# EAGLE schematic Schematic_lamp (EAGLE 9.7.0)
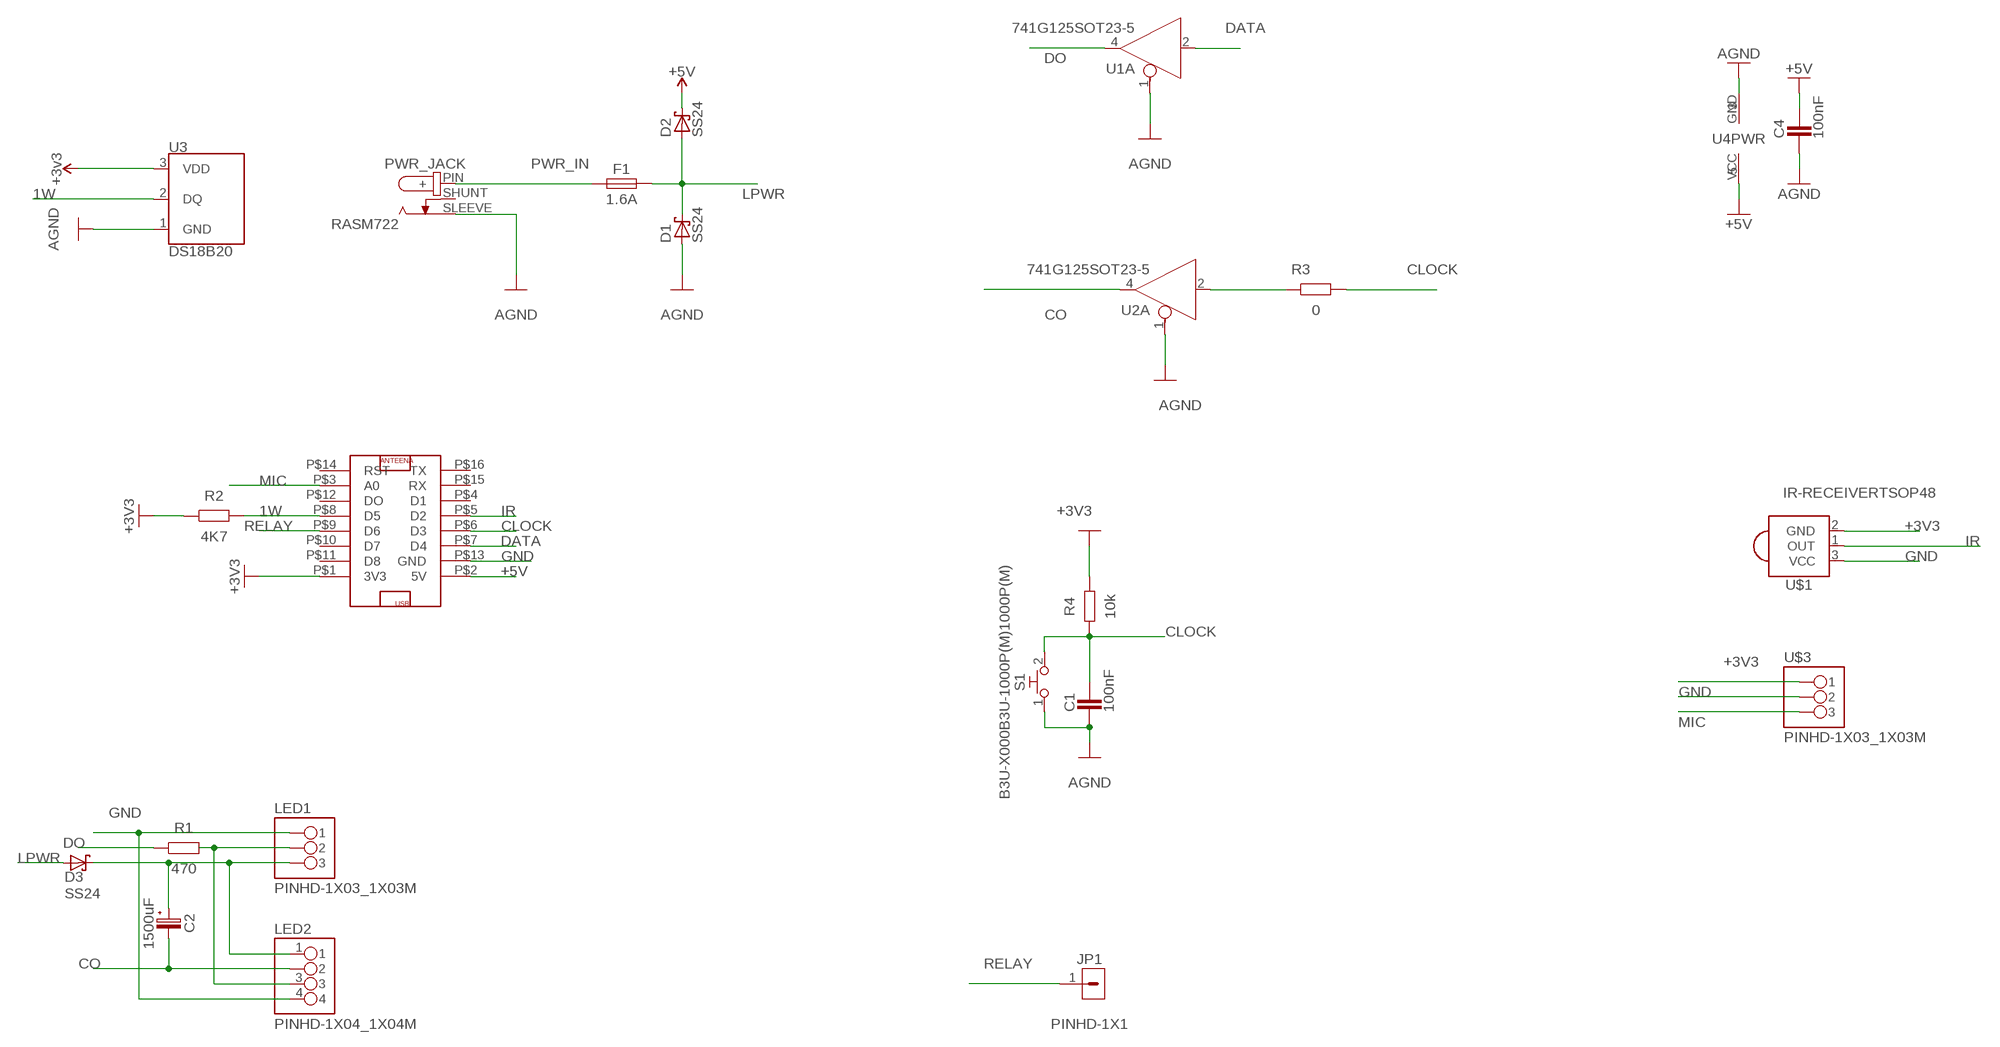
[diagram p0: schematic, sheet 1]

## Parts
C1  100nF  CAPACITOR_CHIP-0402(1005-METRIC)  [CAPC1005X60]
C2  1500uF  C-POL_TANTALUM-1206(3216-METRIC)  [CAPMP3216X180N]
C4  100nF  CAPACITOR_CHIP-0402(1005-METRIC)  [CAPC1005X60]
D1  SS24  SCHOTTKY-DIODEDO13M  [DO13M]
D2  SS24  SCHOTTKY-DIODEDO13M  [DO13M]
D3  SS24  SCHOTTKY-DIODEDO13M  [DO13M]
F1  1.6A  FUSE_AXIAL-26MM-PITCH  [FUSAD2590W70L2150D550B]
JP1  PINHD-1X1  [1X01]
LED1  PINHD-1X03_1X03M  [1X03]
LED2  PINHD-1X04_1X04M  [1X04]
PWR_JACK  RASM722  [RASM722X]
R1  470  R_CHIP-0402(1005-METRIC)  [RESC1005X40]
R2  4K7  R_CHIP-0402(1005-METRIC)  [RESC1005X40]
R3  0  R_CHIP-0402(1005-METRIC)  [RESC1005X40]
R4  10k  R_CHIP-0402(1005-METRIC)  [RESC1005X40]
S1  B3U-X000B3U-1000P(M)1000P(M)  [B3U-1000P(M)]
U1  741G125SOT23-5  [SOT23-5]
U2  741G125SOT23-5  [SOT23-5]
U3  DS18B20  [TO-92-AMMO]
U4  741G125SOT23-5  [SOT23-5]
U$1  IR-RECEIVERTSOP48  [TSOP48]
U$2  WEMOS-D1-MINI  [LAB_PACKAGE]
U$3  PINHD-1X03_1X03M  [1X03]

## Nets
1W: R2.2 U3.2(DQ) U$2.P$8(D5)
+3V3: R2.1 R4.2 U$1.2(GND) U$2.P$1(3V3) U$3.1
+5V: C4.1 U4.5(PWR:VCC) U$2.P$2(5V)
AGND: C1.2 C4.2 D1.A PWR_JACK.SLEEVE(NEG) S1.1 U1.1(A:OE) U2.1(A:OE) U3.1(GND) U4.3(PWR:GND)
CLOCK: C1.1 R3.2 R4.1 S1.2 U$2.P$6(D3)
CO: C2.2(-) LED2.2 U2.4(A:O)
DATA: U1.2(A:I) U$2.P$7(D4)
DO: R1.1 U1.4(A:O)
GND: LED1.1 LED2.4 U$1.3(VCC) U$2.P$13(GND) U$3.2
IR: U$1.1(OUT) U$2.P$5(D2)
LPWR: C2.1(+) D1.C D2.A D3.A D3.C F1.2 LED1.3 LED2.1
MIC: U$2.P$3(A0) U$3.3
N$1: LED1.2 LED2.3 R1.2
N$2: R3.1 U2.2(A:I)
PWR_IN: F1.1 PWR_JACK.PIN(+)
RELAY: JP1.1 U$2.P$9(D6)
VCC: D2.C U3.3(VDD) ; supply symbol labelled +3v3, +5V
Unconnected: PWR_JACK.SHUNT(-) U4.1(A:OE) U4.2(A:I) U4.4(A:O) U$2.P$4(D1) U$2.P$10(D7) U$2.P$11(D8) U$2.P$12(DO) U$2.P$14(RST) U$2.P$15(RX) U$2.P$16(TX)

## Power pins joined to a net without a drawn wire
GND: U1.3(PWR:GND) U2.3(PWR:GND)
VCC: U1.5(PWR:VCC) U2.5(PWR:VCC)

## Library data of the parts
C1 C4 = Tinkercad:CAPACITOR: Capacitor - Generic
C2 = Capacitor:C-POL: Capacitor Polarised - Generic
D1-D3 = adafruit:SCHOTTKY-DIODE: Schottky Diode
F1 = Circuit-Protection:FUSE: Fuse - Generic
JP1 = Connector:PINHD-1X1: Pin Header
LED1 U$3 = Tinkercad:PINHD-1X03
LED2 = Tinkercad:PINHD-1X04
PWR_JACK = Connector:RASM722: CONN PWR JACK 2.1X5.5MM SOLDER
R1-R4 = Resistor:R: Resistor Fixed - Generic
S1 = Switch:B3U-X000: Ultra-small Tactile Switch Contact form : SPST-NO Reference: Datasheet <https://omronfs.omron.com/en_US/ecb/products/pdf/en-b3u.pdf>
U1 U2 U4 = IC_Logic:74*1G125: Single Bus Buffer Gate with 3-State Output
U3 = SparkFun-Sensors:DS18B20: Dallas/Maxim DS18B20 1-Wire Temperature Sensor The DS18B20 reports degrees C with 9 to 12-bit precision, -55C to 125C (+/-0.5C). Each sensor has a unique 64-Bit Serial number etched into it - allows for a huge number of sensors to be used on one data bus. Datasheet <http://datasheets.maximintegrated.com/en/ds/DS18B20.pdf> SparkFun Products One Wire Digital Temperature Sensor - DS18B20 <https://www.sparkfun.com/products/245> (SEN-00245)
U$1 = Tinkercad:IR-RECEIVER
U$2 = LAMP:WEMOS-D1-MINI